# EAGLE design ACS723_Low_Current_Sensor (EAGLE 7.1.0)
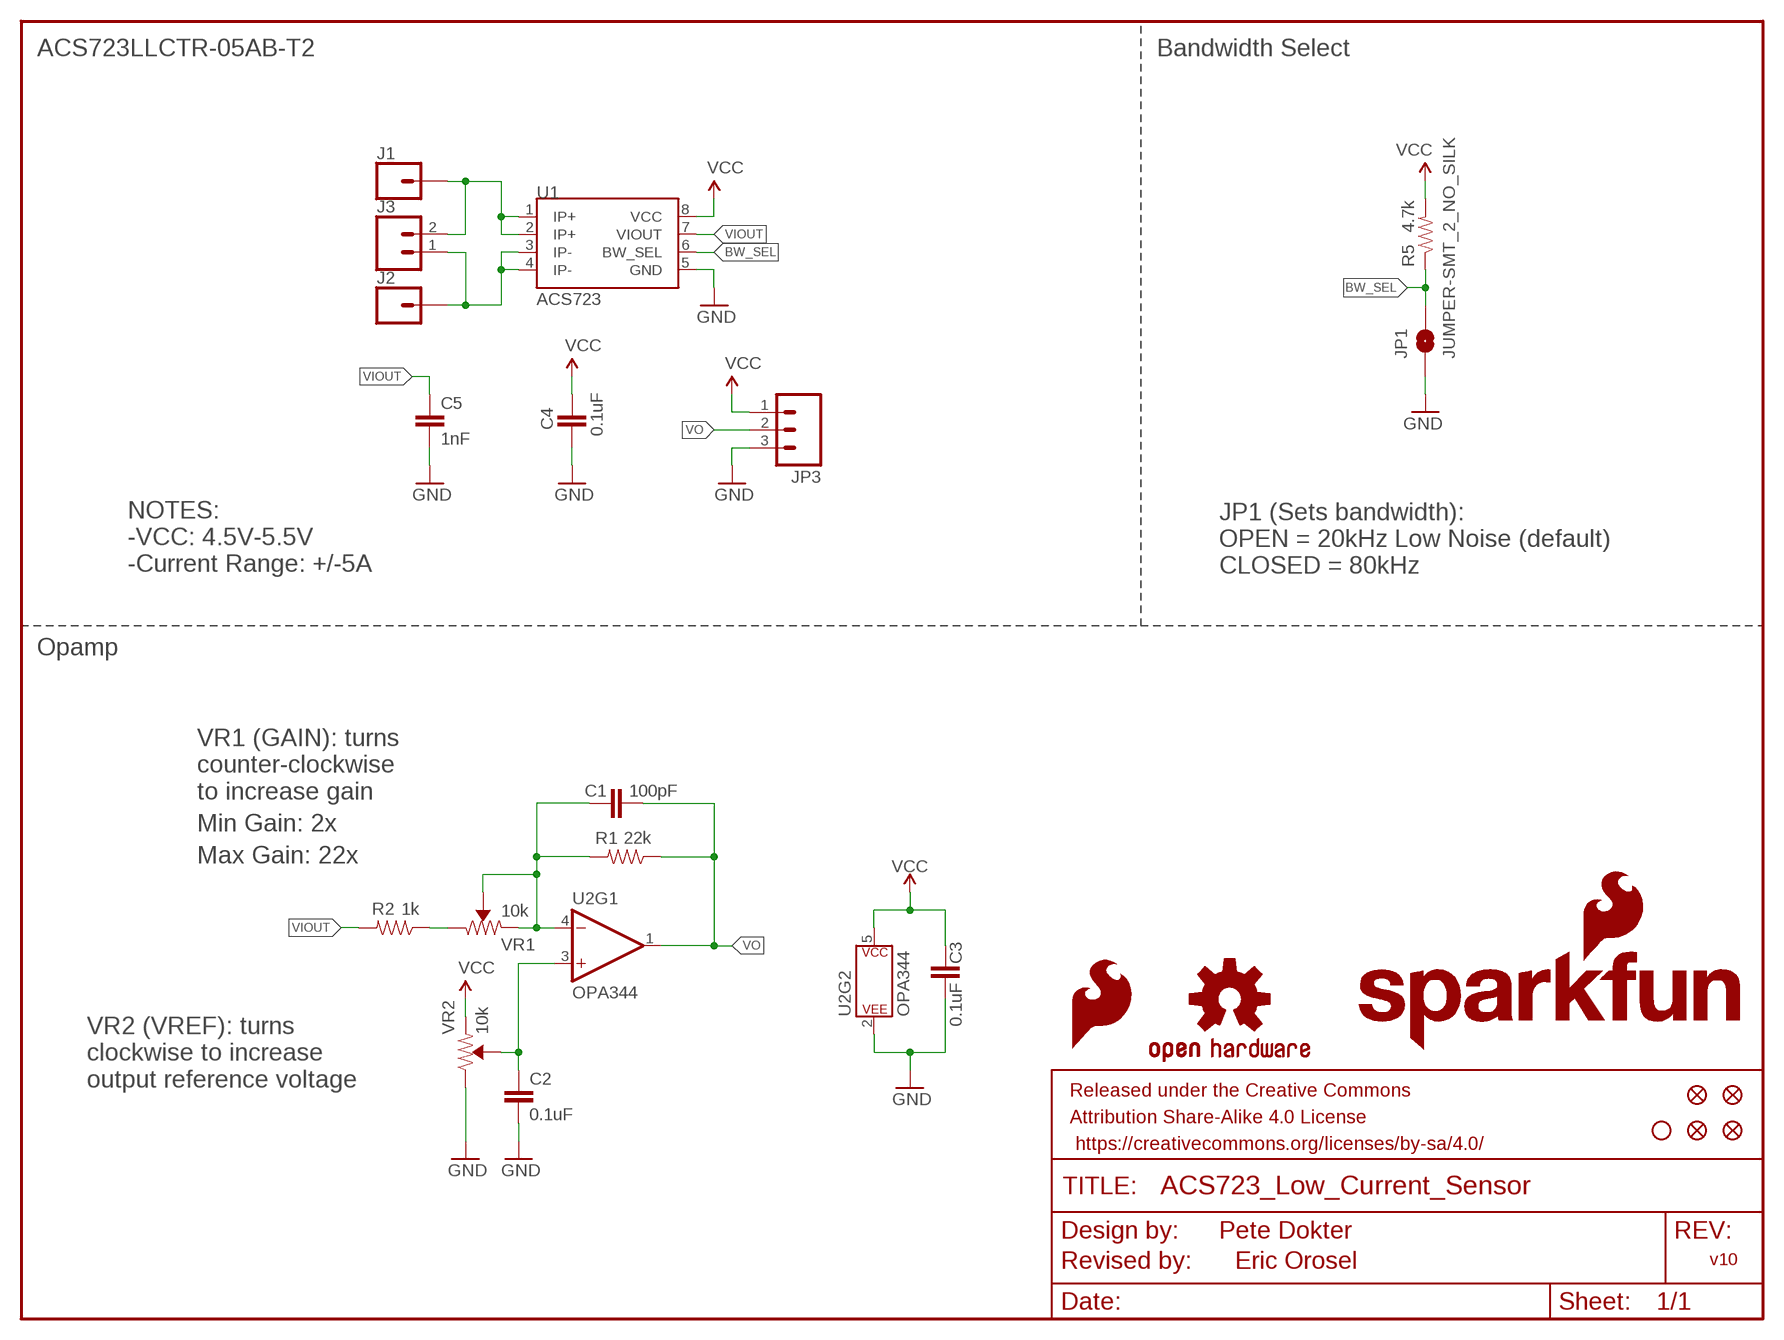
[diagram p0: schematic, sheet 1]

## Parts
C1  100pF  100PF-0603-50V-5%  [0603]
C2  0.1uF  0.1UF-0603-25V-(+80/-20%)  [0603]
C3  0.1uF  0.1UF-0603-25V-(+80/-20%)  [0603]
C4  0.1uF  0.1UF-0603-25V-(+80/-20%)  [0603]
C5  1nF  1.0NF/1000PF-0603-50V-10%  [0603]
FD1  FIDUCIAL1X2  [FIDUCIAL-1X2]
FD2  FIDUCIAL1X2  [FIDUCIAL-1X2]
FD3  FIDUCIAL1X2  [FIDUCIAL-1X2]
FD4  FIDUCIAL1X2  [FIDUCIAL-1X2]
FRAME1  FRAME-LETTER  [CREATIVE_COMMONS]
H1  STAND-OFFTIGHT  [STAND-OFF-TIGHT]
J1  CONN_01SMTSO-256-ET-0.165DIA  [SMTSO-256-ET-0.165DIA]
J2  CONN_01SMTSO-256-ET-0.165DIA  [SMTSO-256-ET-0.165DIA]
J3  CONN_021X02_NO_SILK  [1X02_NO_SILK]
JP1  JUMPER-SMT_2_NO_SILK  [SMT-JUMPER_2_NO_SILK]
JP3  M03PTH  [1X03]
LOGO1  SFE_LOGO_NAME_FLAME.1_INCH  [SFE_LOGO_NAME_FLAME_.1]
LOGO2  OSHW-LOGOS  [OSHW-LOGO-S]
LOGO3  SFE_LOGO_FLAME.1_INCH  [SFE_LOGO_FLAME_.1]
R1  22k  22KOHM-0603-1/10W-1%  [0603]
R2  1k  1KOHM-0603-1/10W-1%  [0603]
R5  4.7k  4.7KOHM-0603-1/10W-1%  [0603]
U1  ACS723  [SO08]
U2  OPA344  [SOT23-5]
VR1  10k  TRIMPOT-SMD-3MM-OPEN-1/10W-25%  [TRIMPOT-SMD-TC33X]
VR2  10k  TRIMPOT-SMD-3MM-OPEN-1/10W-25%  [TRIMPOT-SMD-TC33X]

## Nets
5V: C3.1 C4.2 JP3.1 R5.2 U1.8(VCC) U2.5(P$V+) VR2.3(CCW) ; supply symbol labelled VCC
BW_SEL: JP1.2 R5.1 U1.6(BW_SEL)
GND: C2.2 C3.2 C4.1 C5.2 JP1.1 JP3.3 U1.5(GND) U2.2(P$V-) VR2.1(CW)
IP+: J1.P$1 J3.2 U1.1(IP+) U1.2(IP+)
IP-: J2.P$1 J3.1 U1.3(IP-) U1.4(IP-)
N$4: R2.1 VR1.1(CW)
N$5: C1.2 R1.2 U2.4(-IN) VR1.2(WIPER) VR1.3(CCW)
N$6: C2.1 U2.3(+IN) VR2.2(WIPER)
VIOUT: C5.1 R2.2 U1.7(VIOUT)
VO: C1.1 JP3.2 R1.1 U2.1(OUT)

## Notes on the sheet
- ACS723LLCTR-05AB-T2 | Bandwidth Select
- NOTES: | JP1 (Sets bandwidth):
- -VCC: 4.5V-5.5V | OPEN = 20kHz Low Noise (default)
- -Current Range: +/-5A | CLOSED = 80kHz
- Opamp
- VR1 (GAIN): turns
  counter-clockwise 
  to increase gain
- Min Gain: 2x
- Max Gain: 22x
- VR2 (VREF): turns
  clockwise to increase 
  output reference voltage
- Pete Dokter
- Revised by: | Eric Orosel | v10

## Library data of the parts
C1 = SparkFun-Capacitors:100PF: 100pF/0.1nF ceramic capacitors A capacitor is a passive two-terminal electrical component used to store electrical energy temporarily in an electric field.; PROD_ID: CAP-07883
C2-C4 = SparkFun-Capacitors:0.1UF: 0.1µF ceramic capacitors A capacitor is a passive two-terminal electrical component used to store electrical energy temporarily in an electric field.; PROD_ID: CAP-00810
C5 = SparkFun-Capacitors:1.0NF/1000PF: 1nF/1,000pF ceramic capacitors A capacitor is a passive two-terminal electrical component used to store electrical energy temporarily in an electric field.; PROD_ID: CAP-07886
FD1-FD4 = SparkFun-Aesthetics:FIDUCIAL: Fiducial Alignment Points Point-of-reference for pick-and-place machines and other optical instruments.
FRAME1 = SparkFun-Aesthetics:FRAME-LETTER: Schematic Frame - Letter Standard 8.5x11 US Letter frame
H1 = SparkFun-Hardware:STAND-OFF: Stand Off Drill holes for mechanically mounting via screws, standoffs, etc. Note: Use the keepout ring to avoid running the screw head into surrounding components. Variant Overviews STAND-OFF - Mechanical footprint for a #4 phillips button head screw. STAND-OFF-TIGHT - Mechanical footprint for a #4 phillips button head screw, Example SparkFun Products Screw - Phillips Head (1/4", 4-40, 10 pack) <https://www.sparkfun.com/products/10453> (PRT-10453) Screw - Phillips Head (1/2", 4-40, 10 pack) <https://www.sparkfun.com/products/10452> (PRT-10452) Screw - Phillips Head (3/4", 4-40, 10 pack) <https://www.sparkfun.com/products/10451> (PRT-10451) Screw - Phillips Head (1", 4-40, 10 pack) <https://www.sparkfun.com/products/10450> (PRT-10450)
J1 J2 = SparkFun-Connectors:CONN_01: Single connection point. Often used as Generic Header-pin footprint for 0.1 inch spaced/style header connections On any of the 0.1 inch spaced packages, you can populate with these: Break Away Headers - Straight <https://www.sparkfun.com/products/116> (PRT-00116) Break Away Male Headers - Right Angle <https://www.sparkfun.com/products/553> (PRT-00553) Female Headers <https://www.sparkfun.com/products/115> (PRT-00115) Break Away Headers - Machine Pin <https://www.sparkfun.com/products/117> (PRT-00117) Break Away Female Headers - Swiss Machine Pin <https://www.sparkfun.com/products/743> (PRT-00743) This device is also useful as a general connection point to wire up your design to another part of your project. Our various solder wires solder well into these plated through hole pads. Hook-Up Wire - Assortment (Stranded, 22 AWG) <https://www.sparkfun.com/products/11375> (PRT-11375) Hook-Up Wire - Assortment (Solid Core, 22 AWG) <https://www.sparkfun.com/products/11367> (PRT-11367) View the entire wire category on our website here <https://www.sparkfun.com/categories/141> Special notes: SMTSO-256-ET is a "flush mount" nut for a 4-40 screw. We mostly use this on specialty testbeds; it is a nice way to connect hardware to your PCB at an adjustable hieght. Also note, the SNAP packages are for using a snappable style connector. We sell a baggie of snaps and they are also used on two LilyPad designs: Snap Assortment - 30 pack (male and female) <https://www.sparkfun.com/products/11347> (DEV-11347) LilyPad Arduino SimpleSnap <https://www.sparkfun.com/products/10941> (DEV-10941) LilyPad SimpleSnap Protoboard <https://www.sparkfun.com/products/10940> (DEV-10940); PROD_ID: HW-08694
J3 = SparkFun-Connectors:CONN_02: Multi connection point. Often used as Generic Header-pin footprint for 0.1 inch spaced/style header connections On any of the 0.1 inch spaced packages, you can populate with these: Break Away Headers - Straight <https://www.sparkfun.com/products/116> (PRT-00116) Break Away Male Headers - Right Angle <https://www.sparkfun.com/products/553> (PRT-00553) Female Headers <https://www.sparkfun.com/products/115> (PRT-00115) Break Away Headers - Machine Pin <https://www.sparkfun.com/products/117> (PRT-00117) Break Away Female Headers - Swiss Machine Pin <https://www.sparkfun.com/products/743> (PRT-00743) For SCREWTERMINALS and SPRING TERMINALS visit here: Screw Terimnals on SparkFun.com <https://www.sparkfun.com/search/results?term=Screw+Terminals> (5mm/3.5mm/2.54mm spacing) This device is also useful as a general connection point to wire up your design to another part of your project. Our various solder wires solder well into these plated through hole pads. Hook-Up Wire - Assortment (Stranded, 22 AWG) <https://www.sparkfun.com/products/11375> (PRT-11375) Hook-Up Wire - Assortment (Solid Core, 22 AWG) <https://www.sparkfun.com/products/11367> (PRT-11367) View the entire wire category on our website here <https://www.sparkfun.com/categories/141> Special notes: Molex polarized connector foot print use with: PRT-08233 with associated crimp pins and housings. 2.54_SCREWTERM for use with PRT-10571. 3.5mm Screw Terminal footprints for PRT-08084 5mm Screw Terminal footprints for use with PRT-08432
JP1 = SparkFun-Jumpers:JUMPER-SMT_2_NO: Normally open jumper This jumper has two pads in close proximity to each other. Apply solder to close the connection. Round pads are easier to solder for beginners, but are a lot larger. SparkFun Product that uses the round pads: SparkFun EL Sequencer <https://www.sparkfun.com/products/12781>
JP3 = SparkFun:M03: Header 3 Standard 3-pin 0.1" header. Use with straight break away headers (SKU : PRT-00116), right angle break away headers (PRT-00553), swiss pins (PRT-00743), machine pins (PRT-00117), and female headers (PRT-00115). Molex polarized connector foot print use with SKU : PRT-08232 with associated crimp pins and housings.
LOGO1 = SparkFun-Aesthetics:SFE_LOGO_NAME_FLAME: SparkFun Font Logo w/ Flame This is the SparkFun full logo. The logo on the schematic will always be the same size; the package variant is the height of the flame part of the logo. Default layer for the logo on the board is tSilk.
LOGO2 = SparkFun-Aesthetics:OSHW-LOGO: Open-Source Hardware (OSHW) Logo This logo indicates the piece of hardware it is found on incorporates a OSHW license and/or adheres to the definition of open source hardware found here: http://freedomdefined.org/OSHW
LOGO3 = SparkFun-Aesthetics:SFE_LOGO_FLAME: SparkFun Flame Logo This is the SparkFun flame logo. The logo on the schematic will always be the same size; the package variant is the height of the flame. Default layer for the logo on the board is tSilk.
R1 = SparkFun-Resistors:22KOHM: 22kΩ resistor A resistor is a passive two-terminal electrical component that implements electrical resistance as a circuit element. Resistors act to reduce current flow, and, at the same time, act to lower voltage levels within circuits. - Wikipedia; PROD_ID: RES-07853
R2 = SparkFun-Resistors:1KOHM: 1kΩ resistor A resistor is a passive two-terminal electrical component that implements electrical resistance as a circuit element. Resistors act to reduce current flow, and, at the same time, act to lower voltage levels within circuits. - Wikipedia; PROD_ID: RES-07856
R5 = SparkFun-Resistors:4.7KOHM: 4.7kΩ resistor A resistor is a passive two-terminal electrical component that implements electrical resistance as a circuit element. Resistors act to reduce current flow, and, at the same time, act to lower voltage levels within circuits. - Wikipedia; PROD_ID: RES-07857
U1 = SparkFun-Sensors:ACS723; PART_#: ACS723ACS723LLCTR-05AB-T2; PROD_ID: IC-13872
U2 = SparkFun-IC-Amplifiers:OPA344: Single gate rail-to-rail output op-amp. Inputs extend 300mV past rails. Datasheet <http://www.ti.com/product/OPA344> SparkFun Products SparkFun Low Current Sensor <https://www.sparkfun.com/products/8883> (SEN-08883) SparkFun Electret Microphone Breakout <https://www.sparkfun.com/products/12758> (BOB-12758); PROD_ID: IC-08251
VR1 VR2 = SparkFun-Resistors:TRIMPOT: Trimming Potentiometer (Trimpot) Three-terminal potentiometers, with an adjustable wiper and two adjustable resistors. A pot can be used to create a configurable voltage divider, or as a variable resistor. "Trimpots" are a subset of potentiometers, usually intended for "set-and-forget" applications. They're often more delicate than standard potentiometers - rated for fewer turns. Variants PTH-KNOB - PTH Trimpot w/ finger-adjustable knob Trimpot 10K with Knob <https://www.sparkfun.com/products/9806> (COM-09806) Datasheet <http://www.sparkfun.com/datasheets/Components/General/TSR-3386.pdf> SMD-3MM-CLOSED-FRAME - SMD 3mm Square Closed-Frame Trimpot Used on e.g. EasyDriver - Stepper Motor Driver <https://www.sparkfun.com/products/12779> Datasheet <http://www.bitechnologies.com/pdfs/22.pdf> (22AR10KTR) SMD-5MM - SMD 5mm Square Closed-Frame Trimpot Used on e.g. IOIO-OTG - V2.2 <https://www.sparkfun.com/products/13613> Datasheet <http://www.vishay.com/docs/51008/ts53.pdf> (TS53YL502MR10) SMD-3MM-1/10W-25% - 3mm Square Open-Frame Trimpot Used on e.g. SparkFun Shapeoko <https://www.sparkfun.com/products/13899> Datasheet <http://www.bourns.com/docs/Product-Datasheets/TC33.pdf> (TC33X-2-103E); PROD_ID: RES-12428, RES-08048

## Net classes
1 8_mil: width 0.203 mm
2 10_mil: width 0.254 mm
3 12_mil: width 0.305 mm
4 15_mil: width 0.381 mm
5 20_mil: width 0.508 mm
6 25_mil: width 0.635 mm
7 30_mil: width 0.762 mm

## Board
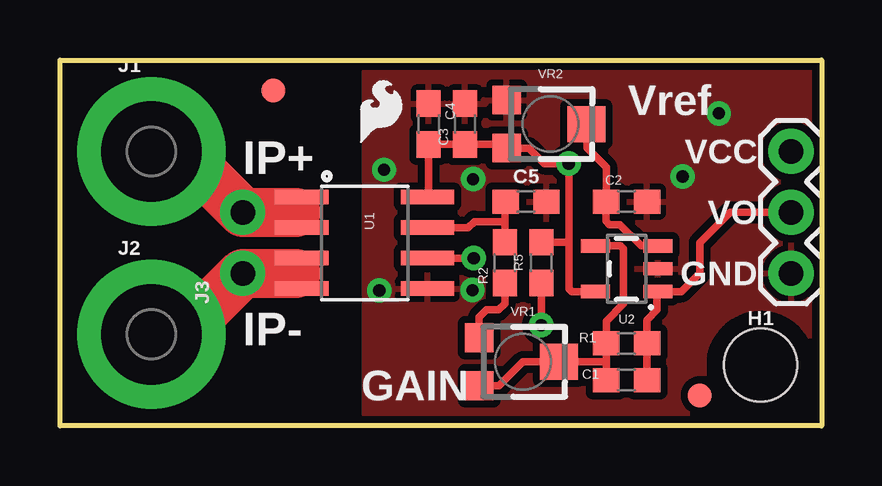
[diagram p1: board, top side]
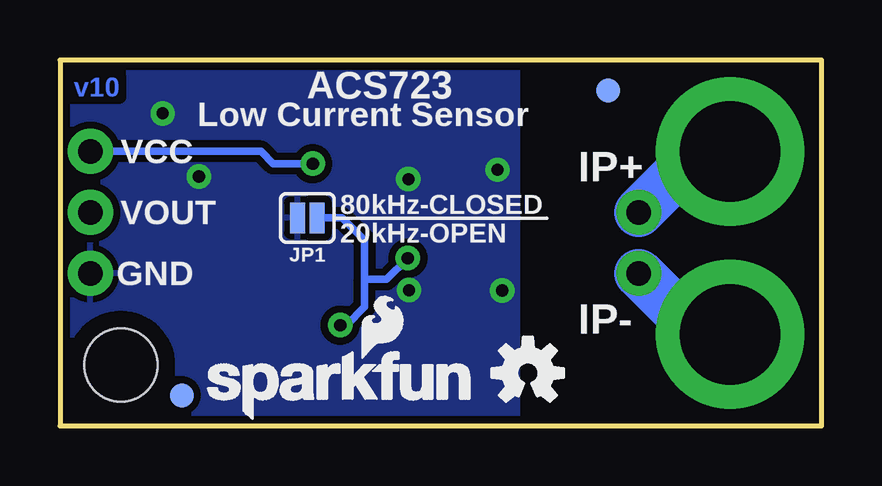
[diagram p2: board, bottom side, seen from below]

Size 31.75 x 15.24 mm. Coordinates in mm from the lower left corner, seen from the top.
Outline: 0,0 0,15.24 31.75,15.24 31.75,0 0,0
Copper layers (1*16): Top 0.035mm / dielectric 1.5mm / Bottom 0.035mm
Design rules "SparkFun-2-layer-STANDARD": minimum track width 10mil, minimum drill 20mil, track to track 10mil, track to pad 8mil, pad to pad 8mil, via to via 10mil, smd to smd 8mil, copper to edge 8mil, drill to drill 8mil, minimum pad ring 10mil, minimum via ring 10mil, stop-mask expansion 4mil, vias tented up to drill 25mil, thermal gap 10mil

### Footprints (pad centres in the part's own frame; a part is rotated, then mirrored left to right if it is on the bottom)
0603 = smd 1.1 x 1: 1 -0.85,0; 2 0.85,0
FIDUCIAL-1X2 = smd 1 x 1: 1 0,0
STAND-OFF-TIGHT = hole 3.048: 0,0
SMTSO-256-ET-0.165DIA = drill 4.191 pad 6.198: P$1 0,0
1X02_NO_SILK = drill 1.016 pad 1.88: 1 0,0; 2 2.54,0
SMT-JUMPER_2_NO_SILK = smd 0.635 x 1.27: 1 -0.406,0; 2 0.406,0
1X03 = drill 1.016 pad 1.88: 1 0,0; 2 2.54,0; 3 5.08,0
SO08 = smd 0.61 x 2.21: 1 -1.905,-2.616; 2 -0.635,-2.616; 3 0.635,-2.616; 4 1.905,-2.616; 5 1.905,2.616; 6 0.635,2.616; 7 -0.635,2.616; 8 -1.905,2.616
SOT23-5 = smd 0.55 x 1.2: 1 -0.95,-1.3; 2 0,-1.3; 3 0.95,-1.3; 4 0.95,1.3; 5 -0.95,1.3
TRIMPOT-SMD-TC33X = smd 1.2 x 1.2: 1 -1,-1.825; 3 1,-1.825 | smd 1.5 x 1.6: 2 0,1.5

### Placement (x,y rotation side)
C1  23.62,1.91 180 top
C2  23.62,9.33 0 top
C3  16.89,12.57 90 top
C4  15.37,12.57 270 top
C5  19.43,9.33 0 top
FD1  8.89,13.97 0 top
FD2  8.89,13.97 0 bottom
FD3  26.67,1.27 0 top
FD4  26.67,1.27 0 bottom
FRAME1  -12.98,-12.7 0 top  (outside the outline)
H1  29.21,2.54 0 top
J1  3.81,11.43 0 top
J2  3.81,3.81 0 top
J3  7.62,6.35 90 top
JP1  21.44,8.66 0 bottom
JP3  30.48,11.43 270 top
LOGO1  26.01,0.18 0 bottom
LOGO2  12.24,2.2 0 bottom
LOGO3  12.23,11.46 0 top
R1  23.62,3.43 180 top
R2  18.54,6.79 90 top
R5  20.07,6.79 90 top
U1  12.7,7.62 270 top
U2  23.62,6.54 90 top
VR1  19.3,2.67 270 top
VR2  20.45,12.57 270 top

### Tracks (layer width: path | path; a pad name or v marks a point on that pad's centre or on a via)
5V  (via drill 0.51)
  Top 0.305: U1.8 15.37,9.58 C4.2 C3.1 18.47,11.72 VR2.3 19.54,11.57 20.19,10.92 v21.21,10.92 21.21,7.62 | U2.5 21.33,5.59 21.21,5.71 21.21,7.62 | R5.2 21.18,7.64 21.21,7.62
  Bottom 0.305: JP3.1 23.37,11.43 22.86,10.92 v21.21,10.92
BW_SEL  (via drill 0.51)
  Top 0.305: U1.6 v17.25,6.99 | R5.1 v20.07,4.19
  Bottom 0.305: v20.07,4.19 19.81,4.19 19.05,4.95 19.05,6.1 | 19.05,6.1 18.14,6.1 v17.25,6.99 | JP1.2 19.99,8.66 19.05,7.72 19.05,6.1
GND  (via drill 0.51)
  other vias: 13.31,5.64 25.96,10.39 13.51,10.67 17.2,5.65 27.47,13.02 17.22,10.27
  pour Bottom (isolate 0.305): 12.7,0.03 31.75,0 31.75,15.24 12.7,15.24
  pour Top (isolate 0.305): 12.7,0.03 31.75,0 31.75,15.24 12.7,15.24
IP+
  Top 0.254: U1.1 10.08,9.14 9.83,8.89 | U1.2 9.53,8.26 8.89,8.89
  Top 2.032: J1.P$1 5.08,11.43 J3.2 8.89,8.89 9.83,8.89
  Bottom 2.032: J3.2 5.08,11.43 J1.P$1
IP-
  Top 0.254: U1.4 9.83,5.97 9.83,6.35 9.83,6.73 U1.3
  Top 2.032: J2.P$1 5.08,3.81 J3.1 9.83,6.35
  Bottom 2.032: J2.P$1 5.08,3.81 J3.1
N$4
  Top 0.305: VR1.1 17.48,4.53 17.78,4.83 18.29,4.83 18.54,5.08 R2.1
N$5
  Top 0.305: U2.4 23.37,7.49 23.5,7.37 23.5,5.08 22.77,4.36 R1.2 22.77,2.67 | VR1.3 18.3,1.67 19.3,2.67 VR1.2 22.77,2.67 | 22.77,2.67 C1.2
N$6
  Top 0.305: U2.3 24.23,7.49 23.34,8.38 22.91,8.38 22.76,8.53 22.76,9.35 | VR2.2 21.97,12.55 21.97,11.58 22.77,10.78 C2.1 22.76,9.35 | 22.76,9.45 22.76,9.35
VIOUT
  Top 0.305: U1.7 17.02,8.26 17.27,8.51 18.54,8.51 | 18.54,8.51 18.54,8.89 | 18.54,8.89 18.54,9.3 | 18.54,8.51 R2.2 | C5.1 18.58,8.93 18.54,8.89
VO
  Top 0.305: C1.1 R1.1 24.47,4.41 24.89,4.83 24.89,5.56 U2.1 25.91,5.59 26.67,6.35 26.67,7.62 27.94,8.89 JP3.2

### Text on the board
Bottom: v10
tPlace: Vref | VCC | IP+ | VO | GND | IP- | GAIN
bPlace: ACS723 | Low Current Sensor | VCC | IP+ | 80kHz-CLOSED | VOUT | 20kHz-OPEN | GND | IP-
tDocu: Pete Dokter | Revised by: | Eric Orosel